# Altium schematic sheet Switch.SchDoc
size Letter
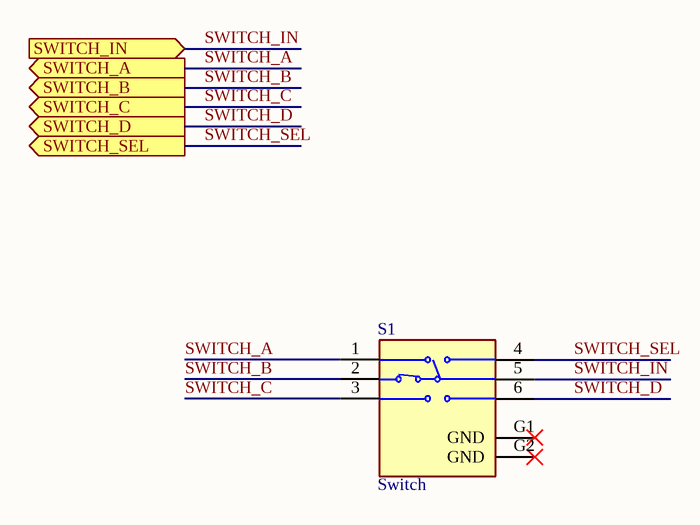
[diagram p0: Switch.SchDoc]

## Parts
S1  Switch  [SW_JS1400AFQ]

## Ports
SWITCH_A (out), SWITCH_B (out), SWITCH_C (out), SWITCH_D (out), SWITCH_IN (in), SWITCH_SEL (out)

## Nets
SWITCH_A: S1.1 ; port SWITCH_A
SWITCH_B: S1.2 ; port SWITCH_B
SWITCH_C: S1.3 ; port SWITCH_C
SWITCH_D: S1.6 ; port SWITCH_D
SWITCH_IN: S1.5 ; port SWITCH_IN
SWITCH_SEL: S1.4 ; port SWITCH_SEL

Not connected (* = marked no-connect by the designer): S1 G1(GND)* G2(GND)*

## Notes on the sheet
- Title:
- Desc:
- Size:
- Letter
- Auth:
- Proj:
- Sheet
- of
- www.seas.upenn.edu
- Electrical and Systems Engineering

## Library data of the parts
S1 = JS1400AFQ: SWITCH NAVIGATION 50MA 12V; MP: JS1400AFQ; Availability: Unavailable; Package: None; Price: None; Value: *